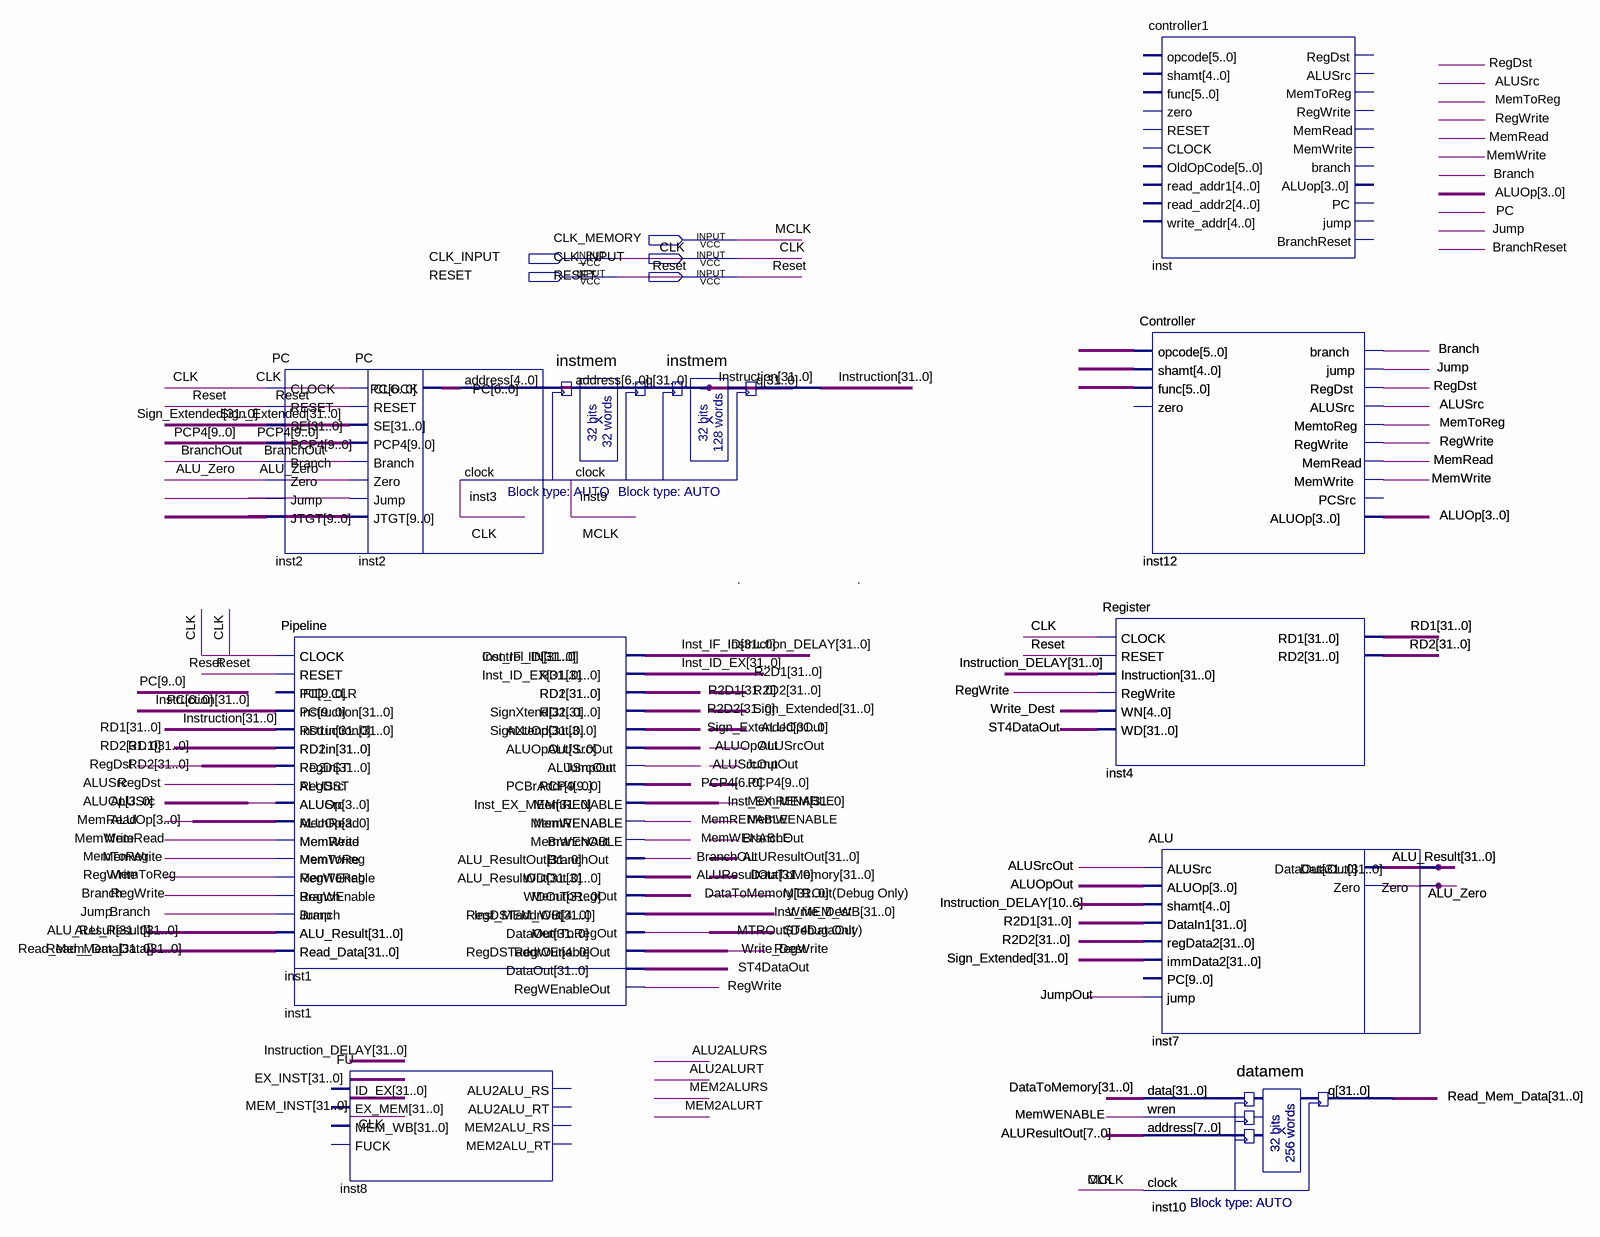
[diagram p0: schematic sheet]
// Quartus schematic MIPS.bdf as structural Verilog: 16 symbols, 5 pins
module MIPS (
  input  CLK_MEMORY,
  input  CLK_INPUT,
  input  RESET
);

  wire ALU_Zero, ALUOpOut, ALUSrc, ALUSrcOut, Branch, BranchOut, inst12_pcsrc, Jump, JumpOut, MemRead,
       MemRENABLE, MemToReg, MemWENABLE, MemWrite, \MTROut(Debug_Only) , RegWrite, ST4DataOut, undriven_4,
       undriven_6, undriven_9, Write_Dest;
  wire [3:0] ALUOp;
  wire [4:0] undriven_2;
  wire [5:0] undriven, undriven_3;
  wire [6:0] inst2_pc, inst2_pc_2, PC;
  wire [9:0] PCP4, undriven_5, undriven_7, undriven_8, undriven_10;
  wire [31:0] ALU_Result, ALUResultOut, DataToMemory, Inst_EX_MEM, Inst_ID_EX, Inst_IF_ID, Inst_MEM_WB,
       Instruction, Instruction_DELAY, R2D1, R2D2, RD1, RD2, Read_Mem_Data, Sign_Extended;

  PC inst2 (
    .CLOCK(CLK_INPUT), .RESET(RESET), .SE(Sign_Extended), .PCP4(PCP4), .Branch(BranchOut), .Zero(ALU_Zero),
    .Jump(undriven_4), .JTGT(undriven_5), .PC(inst2_pc));
  Pipeline inst1 (
    .CLOCK(CLK_INPUT), .RESET(RESET), .PC(undriven_8), .Instruction(PC), .RD1in(Instruction), .RD2in(RD1),
    .RegDST(RD2), .ALUSrc(ALUSrc), .ALUOp({4{ALUSrc}}), .MemRead(ALUOp), .MemWrite(MemRead),
    .MemToReg(MemWrite), .RegWEnable(MemToReg), .Branch(RegWrite), .Jump(Branch), .ALU_Result(ALU_Result),
    .Read_Data(Read_Mem_Data), .Control_IN(Inst_IF_ID), .RD1(Inst_ID_EX), .RD2(R2D1), .SignXtend(R2D2),
    .ALUOpOut(Sign_Extended), .ALUSrcOut(ALUOpOut), .JumpOut(ALUSrcOut), .PCBrAddr(PCP4[6:0]),
    .MemRENABLE(Inst_EX_MEM), .MemWENABLE(MemRENABLE), .BranchOut(MemWENABLE), .ALU_ResultOut(BranchOut),
    .WDOut(ALUResultOut), .MemToRegOut(DataToMemory), .RegDSTaddrOut(Inst_MEM_WB),
    .DataOut(\MTROut(Debug_Only) ), .RegWEnableOut(Write_Dest));
  Pipeline inst1_dup2 (
    .CLOCK(CLK_INPUT), .RESET(RESET), .IFID_CLR(undriven_8), .PC(PC), .Instruction(Instruction), .RD1in(RD1),
    .RD2in(RD2), .RegDST(ALUSrc), .ALUSrc(ALUSrc), .ALUOp(ALUOp), .MemRead(MemRead), .MemWrite(MemWrite),
    .MemToReg(MemToReg), .RegWEnable(RegWrite), .Branch(Branch), .ALU_Result(ALU_Result),
    .Read_Data(Read_Mem_Data), .Inst_IF_ID(Inst_IF_ID), .Inst_ID_EX(Inst_ID_EX), .RD1(R2D1), .RD2(R2D2),
    .SignXtend(Sign_Extended), .ALUOpOut(ALUOpOut), .ALUSrcOut(ALUSrcOut), .PCP4(PCP4[6:0]),
    .Inst_EX_MEM(Inst_EX_MEM), .MemRENABLE(MemRENABLE), .MemWENABLE(MemWENABLE), .BranchOut(BranchOut),
    .ALU_ResultOut(ALUResultOut), .WDOut(DataToMemory), .Inst_MEM_WB(Inst_MEM_WB),
    .MemToRegOut(\MTROut(Debug_Only) ), .RegDSTaddrOut(Write_Dest), .DataOut(ST4DataOut),
    .RegWEnableOut(RegWrite));
  FU inst8 ();  // open: ID_EX, EX_MEM, MEM_WB, FUCK, ALU2ALU_RS, ALU2ALU_RT, MEM2ALU_RS, MEM2ALU_RT
  PC inst2_dup2 (
    .CLOCK(CLK_INPUT), .RESET(RESET), .SE(Sign_Extended), .PCP4(PCP4), .Branch(BranchOut), .Zero(ALU_Zero),
    .Jump(undriven_6), .JTGT(undriven_7), .PC(inst2_pc_2));
  instmem inst3 (.address(inst2_pc), .clock(CLK_INPUT), .q(Instruction));
  instmem inst9 (.address(inst2_pc_2), .clock(CLK_INPUT), .q(Instruction));
  controller1 inst ();  // open: opcode, shamt, func, zero, RESET, CLOCK, OldOpCode, read_addr1, read_addr2, write_addr, RegDst, ALUSrc, MemToReg, RegWrite, MemRead, MemWrite, branch, ALUop, PC, jump, BranchReset
  Controller inst12 (
    .opcode(undriven), .shamt(undriven_2), .func(undriven_3), .zero(undriven_9), .branch(Branch),
    .jump(Jump), .RegDst(ALUSrc), .ALUSrc(ALUSrc), .MemtoReg(MemToReg), .RegWrite(RegWrite),
    .MemRead(MemRead), .MemWrite(MemWrite), .PCSrc(inst12_pcsrc), .ALUOp(ALUOp));
  Controller inst12_dup2 (
    .opcode(undriven), .shamt(undriven_2), .func(undriven_3), .zero(undriven_9), .branch(Branch),
    .jump(Jump), .RegDst(ALUSrc), .ALUSrc(ALUSrc), .MemtoReg(MemToReg), .RegWrite(RegWrite),
    .MemRead(MemRead), .MemWrite(MemWrite), .PCSrc(inst12_pcsrc), .ALUOp(ALUOp));
  Register inst4 (
    .CLOCK(CLK_INPUT), .RESET(RESET), .Instruction(Instruction_DELAY), .RegWrite(RegWrite),
    .WN({5{Write_Dest}}), .WD({32{ST4DataOut}}), .RD1(RD1), .RD2(RD2));
  Register inst4_dup2 (
    .CLOCK(CLK_INPUT), .RESET(RESET), .Instruction(Instruction_DELAY), .RegWrite(RegWrite),
    .WN({5{Write_Dest}}), .WD({32{ST4DataOut}}), .RD1(RD1), .RD2(RD2));
  ALU inst7 (
    .ALUSrc(ALUSrcOut), .ALUOp({4{ALUOpOut}}), .shamt(Instruction_DELAY[10:6]), .DataIn1(R2D1),
    .regData2(R2D2), .immData2(Sign_Extended), .PC(undriven_10), .jump(JumpOut), .DataOut(ALU_Result),
    .Zero(ALU_Zero));
  ALU inst7_dup2 (
    .ALUSrc(ALUSrcOut), .ALUOp({4{ALUOpOut}}), .shamt(Instruction_DELAY[10:6]), .DataIn1(R2D1),
    .regData2(R2D2), .immData2(Sign_Extended), .PC(undriven_10), .jump(JumpOut), .DataOut(ALU_Result),
    .Zero(ALU_Zero));
  datamem inst10 (
    .data(DataToMemory), .wren(MemWENABLE), .address(ALUResultOut[7:0]), .clock(CLK_INPUT), .q(Read_Mem_Data));
  datamem inst10_dup2 (
    .data(DataToMemory), .wren(MemWENABLE), .address(ALUResultOut[7:0]), .clock(CLK_INPUT), .q(Read_Mem_Data));

  assign CLK_MEMORY = CLK_INPUT;

  // Other names for the same wires on the sheet: RegDst = ALUSrc; CLK = CLK_INPUT; MCLK = CLK_INPUT

  // Notes on the sheet:
  //   .
  //   .
endmodule
